# EAGLE design XBee_nRF52840_2.2_april_2022 (EAGLE 9.6.2)
COMPANY: JKSOFT Educational; REV: 1.1; TITLE: RPBee nRF52

## Sheet 1 of 2
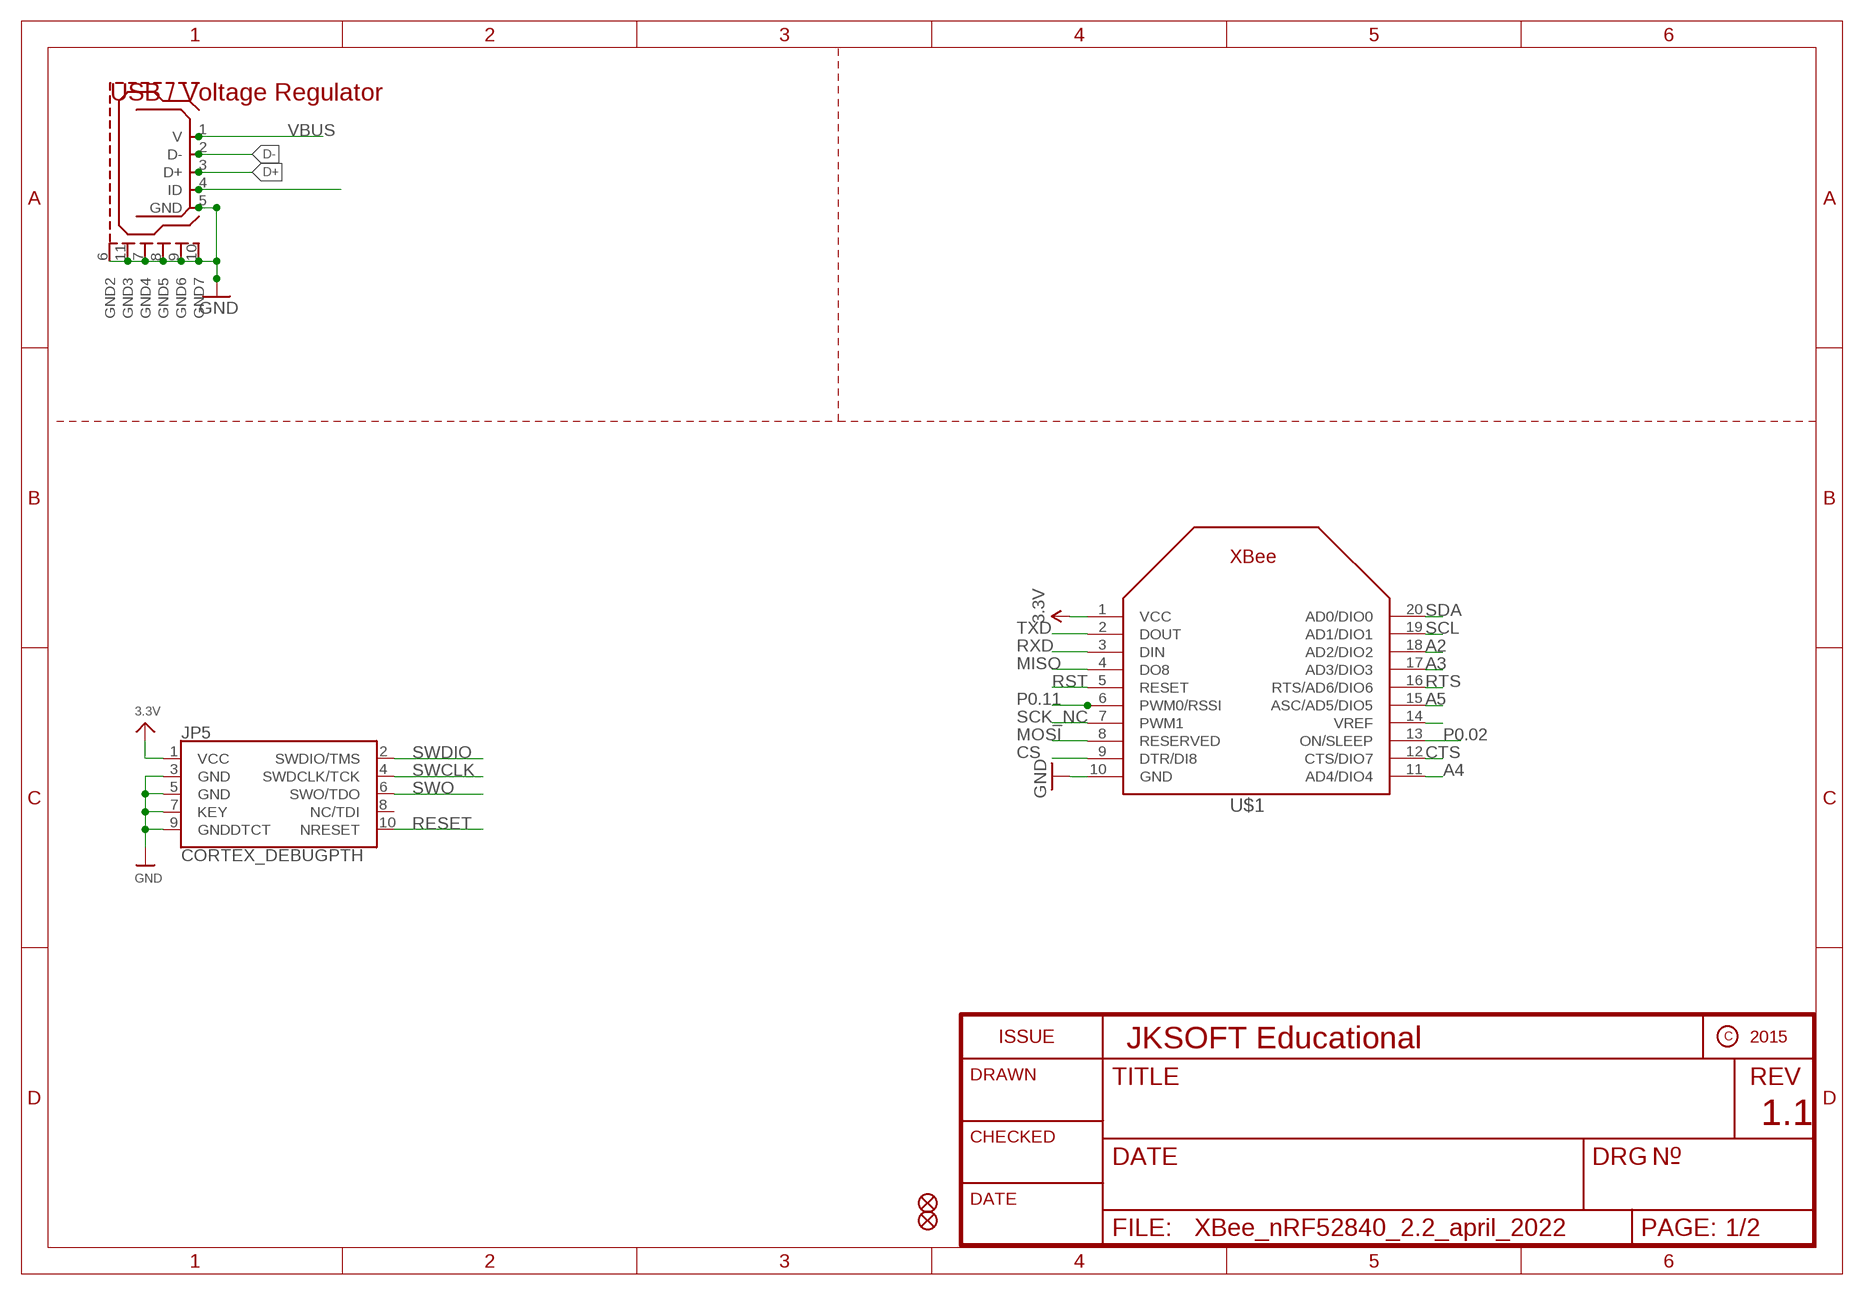
[diagram p0: schematic, sheet 1]

### Parts
FID1  FIDUCIAL_1MM  [FIDUCIAL_1MM]
FID3  FIDUCIAL_1MM  [FIDUCIAL_1MM]
JP5  CORTEX_DEBUGPTH  [2X5-PTH-1.27MM]
U$1  XBEE  [XBEE]
U$2  USB_MICROB  [USB_MICROB_PACKAGE]

### Nets
3.3V: JP5.1(VCC) U$1.1(VCC) ; also sheet 2
A2: U$1.18(AD2/DIO2) ; also sheet 2
A3: U$1.17(AD3/DIO3) ; also sheet 2
A4: U$1.11(AD4/DIO4) ; also sheet 2
A5: U$1.15(ASC/AD5/DIO5) ; also sheet 2
CS: U$1.9(DTR/DI8)
CTS: U$1.12(CTS/DIO7)
D+: U$2.3(D+) ; also sheet 2
D-: U$2.2(D-) ; also sheet 2
GND: JP5.3(GND) JP5.5(GND) JP5.7(KEY) JP5.9(GNDDTCT) U$1.10(GND) U$2.5(GND) U$2.6(GND2) U$2.7(GND4) U$2.8(GND5) U$2.9(GND6) U$2.10(GND7) U$2.11(GND3) ; also sheet 2
MISO: U$1.4(DO8) ; also sheet 2
MOSI: U$1.8(RESERVED) ; also sheet 2
N$2: U$1.14(VREF)
N$4: U$2.4(ID)
P0.02: U$1.13(ON/SLEEP)
P0.11: U$1.6(PWM0/RSSI)
RESET: JP5.10(NRESET) ; also sheet 2
RST: U$1.5(RESET)
RTS: U$1.16(RTS/AD6/DIO6)
RXD: U$1.3(DIN) ; also sheet 2
SCK_NC: U$1.7(PWM1)
SCL: U$1.19(AD1/DIO1) ; also sheet 2
SDA: U$1.20(AD0/DIO0) ; also sheet 2
SWCLK: JP5.4(SWDCLK/TCK) ; also sheet 2
SWDIO: JP5.2(SWDIO/TMS) ; also sheet 2
SWO: JP5.6(SWO/TDO) ; also sheet 2
TXD: U$1.2(DOUT) ; also sheet 2
VBUS: U$2.1(V) ; also sheet 2
Unconnected: JP5.8(NC/TDI)

### Notes on the sheet
- USB / Voltage Regulator

## Sheet 2 of 2
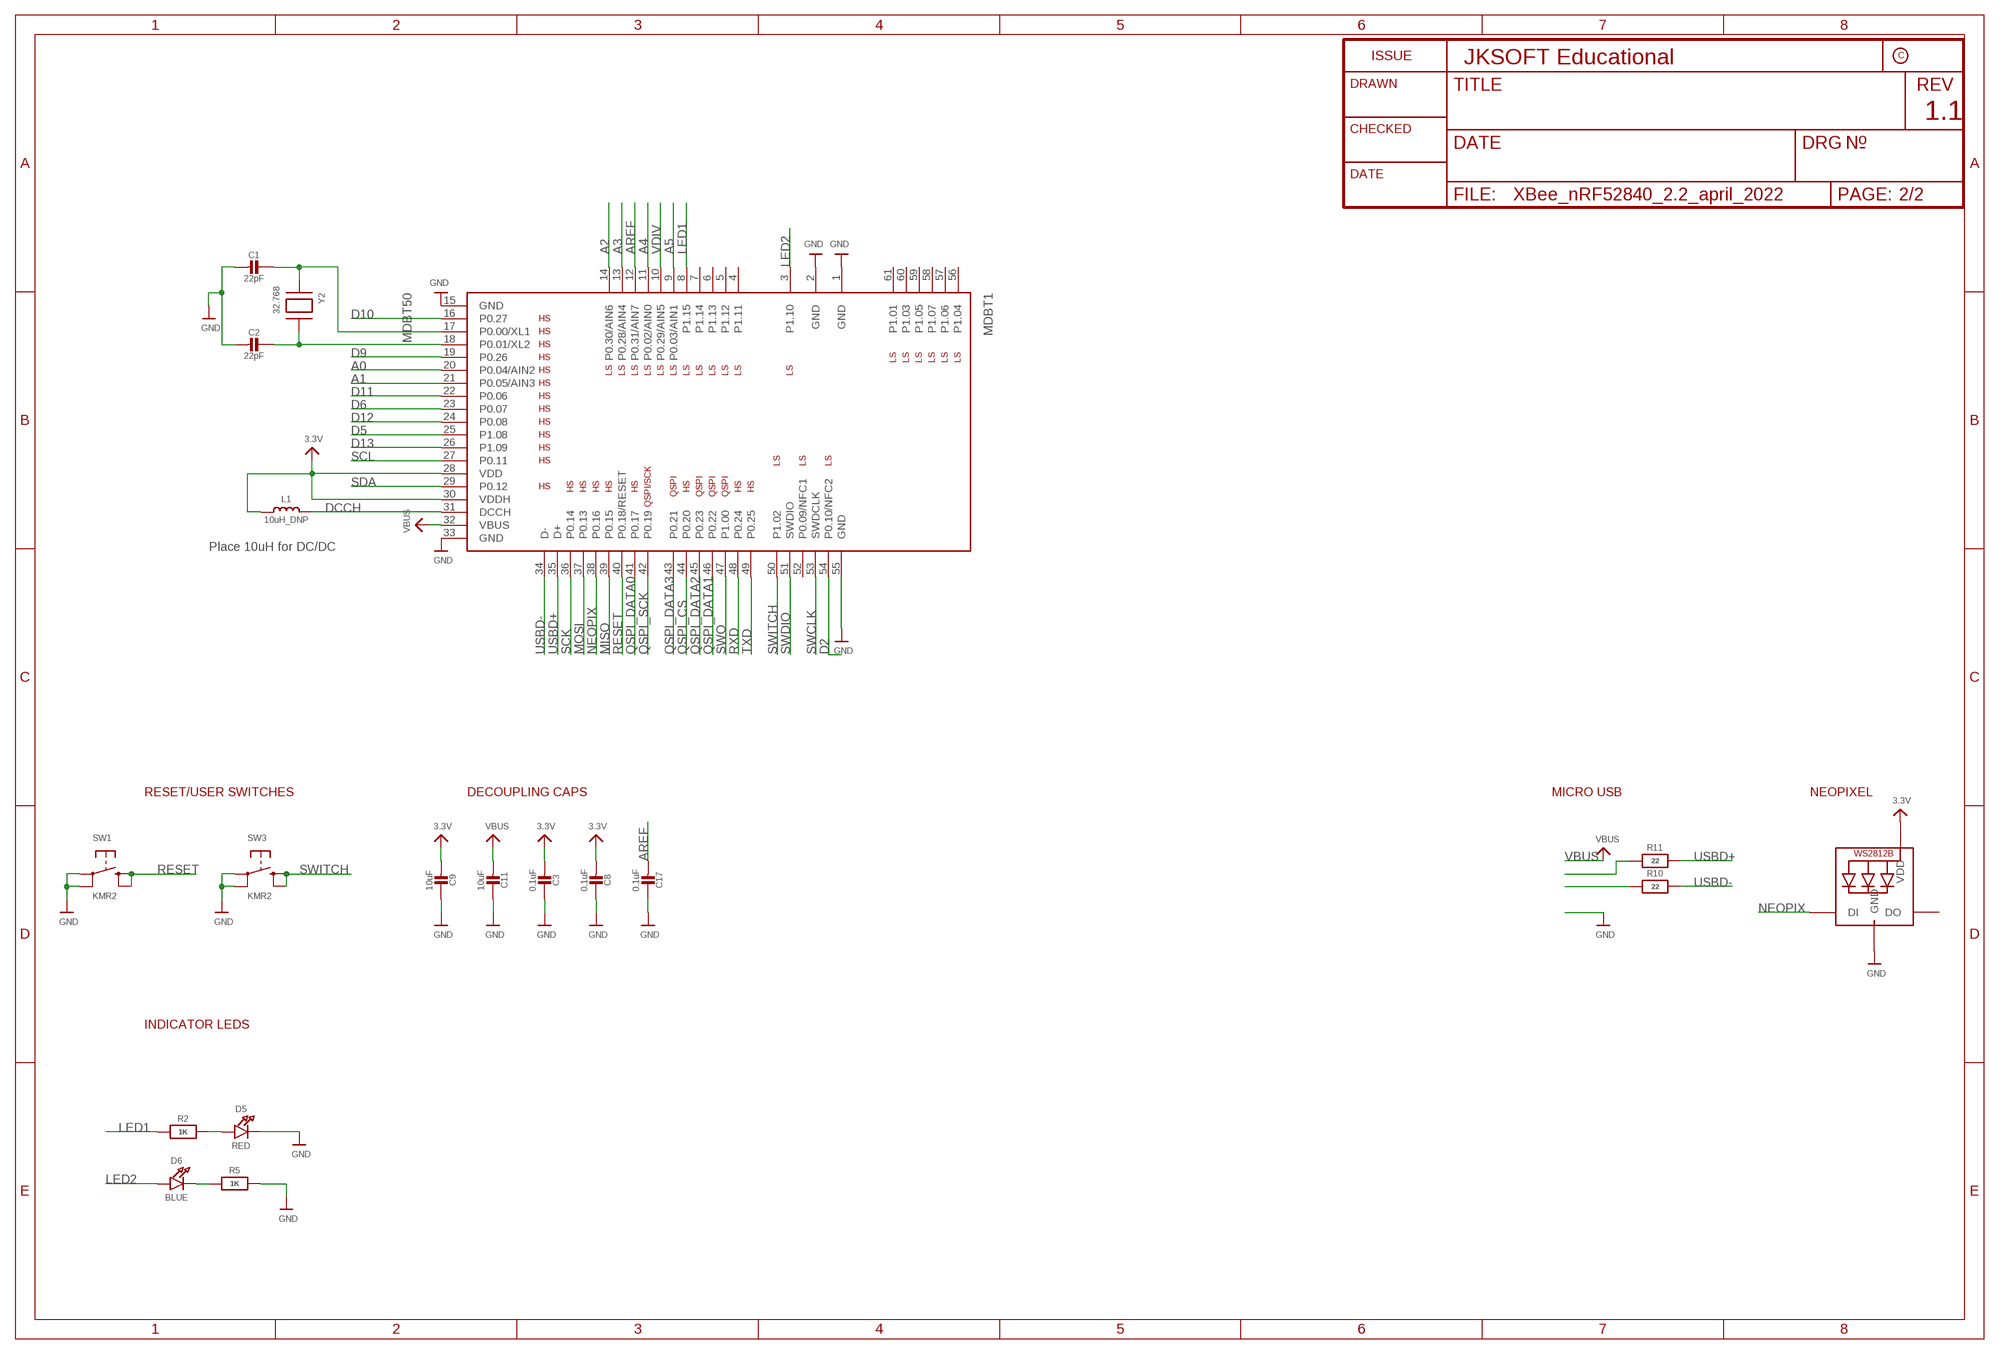
[diagram p1: schematic, sheet 2]

### Parts
C1  22pF  CAP_CERAMIC0603_NO  [0603-NO]
C2  22pF  CAP_CERAMIC0603_NO  [0603-NO]
C3  0.1uF  CAP_CERAMIC0603_NO  [0603-NO]
C8  0.1uF  CAP_CERAMIC0603_NO  [0603-NO]
C9  10uF  CAP_CERAMIC0805-NOOUTLINE  [0805-NO]
C11  10uF  CAP_CERAMIC0805-NOOUTLINE  [0805-NO]
C17  0.1uF  CAP_CERAMIC0603_NO  [0603-NO]
D5  RED  LED0805_NOOUTLINE  [CHIPLED_0805_NOOUTLINE]
D6  BLUE  LED0805_NOOUTLINE  [CHIPLED_0805_NOOUTLINE]
L1  10uH_DNP  INDUCTOR_0805MP  [_0805MP]
LED1  WS2812B3535  [LED3535]
MDBT1  MDBT50  [MDBT50]
R2  1K  RESISTOR_0603_NOOUT  [0603-NO]
R5  1K  RESISTOR_0603_NOOUT  [0603-NO]
R10  22  RESISTOR_0603_NOOUT  [0603-NO]
R11  22  RESISTOR_0603_NOOUT  [0603-NO]
SW1  KMR2  SWITCH_TACT_SMT4.6X2.8  [BTN_KMR2_4.6X2.8]
SW3  KMR2  SWITCH_TACT_SMT4.6X2.8  [BTN_KMR2_4.6X2.8]
Y2  32.768  XTAL-3.2X1.5  [XTAL3215]

### Nets
3.3V: C3.2 C8.2 C9.2 L1.1 LED1.2(VDD) MDBT1.28(VDD) MDBT1.30(VDDH) ; also sheet 1
A0: MDBT1.20(P0.04/AIN2)
A1: MDBT1.21(P0.05/AIN3)
A2: MDBT1.14(P0.30/AIN6) ; also sheet 1
A3: MDBT1.13(P0.28/AIN4) ; also sheet 1
A4: MDBT1.11(P0.02/AIN0) ; also sheet 1
A5: MDBT1.9(P0.03/AIN1) ; also sheet 1
AREF: C17.2 MDBT1.12(P0.31/AIN7)
D2: MDBT1.54(P0.10/NFC2)
D5: MDBT1.25(P1.08)
D6: MDBT1.23(P0.07)
D9: MDBT1.19(P0.26)
D10: MDBT1.16(P0.27)
D11: MDBT1.22(P0.06)
D12: MDBT1.24(P0.08)
D13: MDBT1.26(P1.09)
D+: R11.1 ; also sheet 1
D-: R10.1 ; also sheet 1
DCCH: L1.2 MDBT1.31(DCCH)
GND: C1.2 C2.2 C3.1 C8.1 C9.1 C11.1 C17.1 D5.C LED1.4(GND) MDBT1.1(GND) MDBT1.2(GND) MDBT1.15(GND) MDBT1.33(GND) MDBT1.55(GND) R5.2 SW1.A'(P1) SW1.A(P) SW3.A'(P1) SW3.A(P) ; also sheet 1
LED1: MDBT1.8(P1.15) R2.1
LED2: D6.A MDBT1.3(P1.10)
MISO: MDBT1.39(P0.15) ; also sheet 1
MOSI: MDBT1.37(P0.13) ; also sheet 1
N$1: C1.1 MDBT1.17(P0.00/XL1) Y2.P$1
N$5: C2.1 MDBT1.18(P0.01/XL2) Y2.P$2
N$14: D6.C R5.1
N$15: D5.A R2.2
NEOPIX: LED1.1(DI) MDBT1.38(P0.16)
QSPI_CS: MDBT1.44(P0.20)
QSPI_DATA0: MDBT1.41(P0.17)
QSPI_DATA1: MDBT1.46(P0.22)
QSPI_DATA2: MDBT1.45(P0.23)
QSPI_DATA3: MDBT1.43(P0.21)
QSPI_SCK: MDBT1.42(P0.19)
RESET: MDBT1.40(P0.18/RESET) SW1.B'(S1) SW1.B(S) ; also sheet 1
RXD: MDBT1.48(P0.24) ; also sheet 1
SCK: MDBT1.36(P0.14)
SCL: MDBT1.27(P0.11) ; also sheet 1
SDA: MDBT1.29(P0.12) ; also sheet 1
SWCLK: MDBT1.53(SWDCLK) ; also sheet 1
SWDIO: MDBT1.51(SWDIO) ; also sheet 1
SWITCH: MDBT1.50(P1.02) SW3.B'(S1) SW3.B(S)
SWO: MDBT1.47(P1.00) ; also sheet 1
TXD: MDBT1.49(P0.25) ; also sheet 1
USBD+: MDBT1.35(D+) R11.2
USBD-: MDBT1.34(D-) R10.2
VBUS: C11.2 MDBT1.32(VBUS) ; also sheet 1
VDIV: MDBT1.10(P0.29/AIN5)
Unconnected: LED1.3(DO) MDBT1.4(P1.11) MDBT1.5(P1.12) MDBT1.6(P1.13) MDBT1.7(P1.14) MDBT1.52(P0.09/NFC1) MDBT1.56(P1.04) MDBT1.57(P1.06) MDBT1.58(P1.07) MDBT1.59(P1.05) MDBT1.60(P1.03) MDBT1.61(P1.01)

### Notes on the sheet
- Place 10uH for DC/DC
- RESET/USER SWITCHES | DECOUPLING CAPS | MICRO USB | NEOPIXEL
- INDICATOR LEDS

## Library data of the parts
C1-C3 C8 C9 C11 C17 = microbuilder:CAP_CERAMIC: Ceramic Capacitors For new designs, use the packages preceded by an '_' character since they are more reliable: The following footprints should be used on most boards: _0402 - Standard footprint for regular board layouts _0603 - Standard footprint for regular board layouts _0805 - Standard footprint for regular board layouts _1206 - Standard footprint for regular board layouts For extremely tight-pitch boards where space is at a premium, the following 'micro-pitch' footprints can be used (smaller pads, no silkscreen outline, etc.): _0402MP - Micro-pitch footprint for very dense/compact boards _0603MP - Micro-pitch footprint for very dense/compact boards _0805MP - Micro-pitch footprint for very dense/compact boards _1206MP - Micro-pitch footprint for very dense/compact boards
D5 D6 = microbuilder:LED: LED 0603 - 0603 Surface Mount Package 2mA: Green LED - Low Power (3.9mcd, 2ma, 1.7Vf) - Digikey: 475-2709-2-ND Orange LED - Low Power (9.8mcd, 2ma, 1.8Vf) - Digikey: 475-1194-2-ND Red LED - Low Power (5mcd, 2ma, 1.8Vf) - Digikey: 475-1195-2-ND Yellow LED - Low Power (7mcd, 2ma, 1.8Vf) - Digikey: 475-1196-2-ND 5mA: Blue LED - Low Power (17mcd, 5ma, 2.9Vf) - Digikey: LNJ937W8CRACT-ND 0805 - 0805 Surface Mount Package 2mA: Red LED (8.8mcd, 2mA, 1.8Vf, Clear) - Low Power [Digikey: 475-2510-1-ND] Green LED (5mcd, 2mA, 1.8Vf, Clear) - Low Power [Digikey: 475-2730-1-ND] Yellow LED (11.3mcd, 2mA, 1.8Vf, Clear) - Low Power [Digikey: 475-2555-1-ND] 20mA: Red LED (104mcd, 20mA, Diffused) - LS R976 [Digikey: 475-1278-6-ND] Red LED (12mcd, 20mA, 2.0Vf, Clear) - APT2012EC [Digikey: 754-1128-1-ND] Green LED (15mcd, 20mA, 2.2Vf, Clear) - APT2012GC [Digikey: 754-1131-1-ND] Orange LED (160mcd, 20mA, 2.1Vf, Clear) - APT2012SECK [Digikey: 754-1130-1-ND] 1206 - 1206 Surface Mount Package Green LED (26mcd, 20mA, Diffused) - LG N971 [Digikey: 475-1407-6-ND] Red LED (15mcd, 20mA, Diffused) - LH N974 [Digikey: 475-1416-6-ND] Cree - Cree High-Power Surface Mount LEDs XPEBWT-L1-0000-00D50 - White 111lm 350mA 2.9Vf 6200K 110° XTEAWT-00-0000-00000LEE3 - White 114lm 350mA 2.85Vf 5000K 115° Everlight - Everlight 45-21 Series Surface Mount LEDs 45-21/QK2C-B2832AC2CB2/2T - Warm White 2000mcd 20mA 3.25Vf 3050K 120° 45-21/LK2C-B38452C4CB2/2T - Nuetral White 2000mcd 20mA 3.25Vf 4150K 120° 45-21/LK2C-B50634C6CB2/2T - Cold White 2200mcd 20mA 3.25Vf 5650K 120° PLCC2 Reverse Mount LS T77K-J1L2-1-0-2-R18-Z - Red 11.25mcd 2mA 1.8Vf 630nm 120° LO T77K-L1M2-24-Z - Orange 19.6mcd 2mA 1.8Vf 606nm 120° LY T77K-K2M1-26-Z - Yellow 15.7mcd 2mA 1.8Vf 587nm 120°
FID1 FID3 = microbuilder:FIDUCIAL: Fiducial Alignment Points Various fiducial points for machine vision alignment.; BOM: EXCLUDE
JP5 = samd21-temp:CORTEX_DEBUG: Cortex Debug Connector Datasheet <http://infocenter.arm.com/help/topic/com.arm.doc.faqs/attached/13634/cortex_debug_connectors.pdf>
L1 = microbuilder:INDUCTOR: Inductors 0603: 10nH Ceramic Inductor - microwire antenna/RF (Digikey: 712-1434-2-ND) 0805: 560nH Ceramic Inductor - RF (Digikey: 553-1047-1-ND) 270nH Ceramic Inductor - Q = 40@250MHz, +-5%, 1 Ohm DC Resistance (Digikey: 535-10506-2-ND) 1007 (2518 Metric) SMT: 10µH 10% 250mOhm 820mA 1007 Inductor (Digikey: 587-2189-1-ND) 22µH 10% 500mOhm 580mA 1007 Inductor (Digikey: 587-2190-1-ND) 47µH 10% 950mOhm 420mA 1007 Inductor (Digikey: 587-2191-1-ND) 47µH 5% 100mOhm 1A 1008 Inductor (Digikey: 732-1816-1-ND) 5.0x5.0mm (Taiyo Yuden NR5040 Series) 6.8µH 20% 2.3A 64mOhm Inductor (Digikey: 587-2374-2-ND) 5.0x5.0mm (TDK VLC5045 Series) 4.7µH 20% 3.3A 34mOhm Inductor (Digikey: 445-6526-1-ND) 6.8µH 20% 2.7A 46mOhm Inductor (Digikey: 445-6527-1-ND) 6.0x6.0mm (TDK VLC6045 Series) 4.7µH 20% 3.8A 27mOhm Inductor (Digikey: 445-6538-2-ND) 6.8µH 20% 3A 41mOhm Inductor (Digikey: 445-6540-1-ND) 6.2µH 30% 2.2A 45mOhm Inductor (Digikey: SRR5028-6R2YCT-ND) - Not TDK VLC6045 but footprint should match 6.0x6.0mm (TDK SLF6045 Series) 6.8uH 30% 2A 33mOhm Inductor (Digikey: 445-4572-1-ND, Mouser: 810-SLF645T6R8N2R0PF) 6.0x6.0mm (Sumida CDRH5D28 Series) 6.2uH 30% 1.8A 45mOhm Inductor (Digikey: 308-1542-1-ND) Taiyo Yuden NR3015T2R2M - 2.2uH 20% 1.5A (Digikey: 587-1648-2-ND, Mouser: 963-NR3015T2R2M) - Used with TI TPS62172 CoilCraft RFID Transponder Coil - MA5532-AE (For use with AS3935 Lightning Sensor) Taiyo Yuden NRH2412T2R2MNGH - 2.2uH 20% 1AA (Digikey: 587-3443-1-ND) - Used with TI LM3671 Vishay IHLP 1.0uH Molded Inductor - 24mOhm DCR, 5A, +/-20%, -55°C-125°C (Digikey: 541-1319-1-ND)
LED1 = microbuilder:WS2812B
MDBT1 = microbuilder:MDBT50: Raytac Corporation MDBT50 Bluetooth Low Energy Module based on Noridc nRF52840 Source: Raytac datasheet
R2 R5 R10 R11 = microbuilder:RESISTOR: Resistors For new designs, use the packages preceded by an '_' character since they are more reliable: The following footprints should be used on most boards: _0402 - Standard footprint for regular board layouts _0603 - Standard footprint for regular board layouts _0805 - Standard footprint for regular board layouts _1206 - Standard footprint for regular board layouts For extremely tight-pitch boards where space is at a premium, the following 'micro-pitch' footprints can be used (smaller pads, no silkscreen outline, etc.): _0402MP - Micro-pitch footprint for very dense/compact boards _0603MP - Micro-pitch footprint for very dense/compact boards _0805MP - Micro-pitch footprint for very dense/compact boards _1206MP - Micro-pitch footprint for very dense/compact boards
SW1 SW3 = microbuilder:SWITCH_TACT_SMT: SMT Tact Switches 6x6mm - Digikey: P12940SCT-ND KMR2 (4.6x2.8mm) - Digikey: 401-1426-1-ND EVQ-PQHB55 - Light Touch, 160GF (4.5x4.5mm) - Digikey: P8090SCT-ND KMT0 - KMT021 NGJ LHS (etc.) IP68/Waterproof - Digikey: CKN10289CT-ND
U$1 = adafruit:XBEE
U$2 = femtoduino:USB_MICROB: This is the hirose ZX62-B-5PA(11) MICRO-USB B Type female connection.
Y2 = adafruit2:XTAL: Low cost SMT crystals, no capacitors included http://www.ladyada.net/library/eagle

## Net classes
1 power: width 0.254 mm

## Board
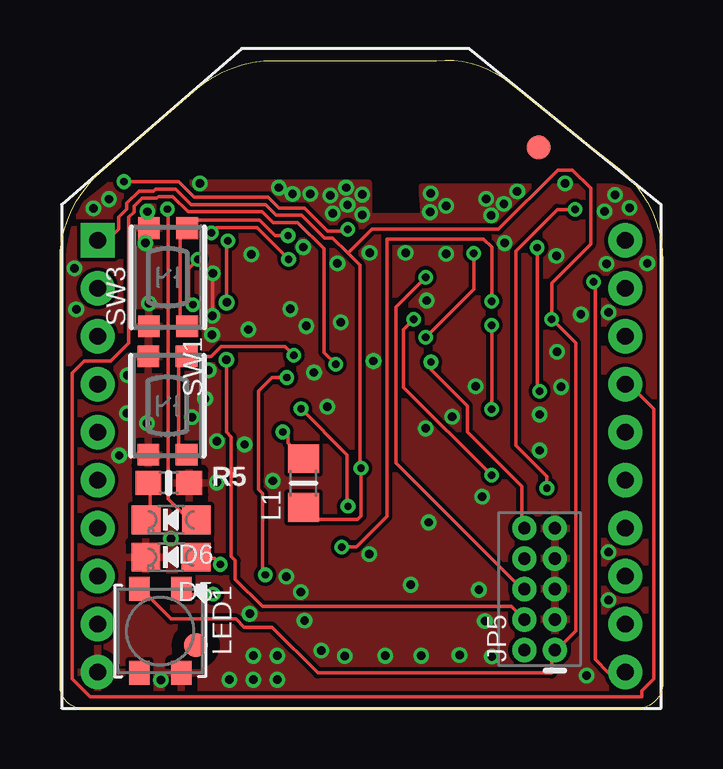
[diagram p2: board, top side]
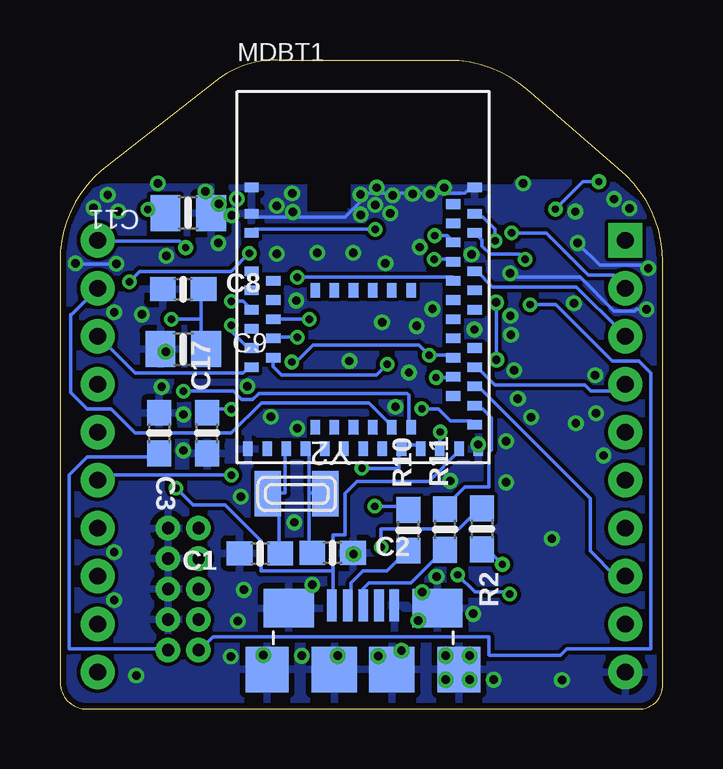
[diagram p3: board, bottom side, seen from below]

Size 25.14 x 27.06 mm. Coordinates in mm from the lower left corner, seen from the top.
Outline: 1.85,22.53 5.65,25.82 arc-41 8.93,27.04 15.69,27.04 arc-41 18.47,26.31 23.42,22.45 arc-49 25.14,18.67 25.14,1.09 arc-90 24,0 1,0 arc-90 0,1 0,18.64 arc-51 1.85,22.53
Copper layers (1*16): Top 0.035mm / dielectric 1.5mm / Bottom 0.035mm
Design rules "SeeedStudio_2layer_DRU_no_angle_20140221": minimum track width 6mil, minimum drill 12mil, track to track 6mil, track to pad 6mil, pad to pad 6mil, via to via 6mil, smd to smd 0mil, copper to edge 10mil, drill to drill 10mil, minimum pad ring 10mil, minimum via ring 6mil, stop-mask expansion 2mil, vias tented up to drill 100mil, thermal gap 10mil

### Footprints (pad centres in the part's own frame; a part is rotated, then mirrored left to right if it is on the bottom)
0603-NO = smd 1.075 x 1: 1 -0.85,0; 2 0.85,0
0805-NO = smd 1.24 x 1.5: 1 -0.95,0; 2 0.95,0
CHIPLED_0805_NOOUTLINE = smd 1.2 x 1.2: A 0,-1.05; C 0,1.05
FIDUCIAL_1MM = smd 1 x 1: 1 0,0
2X5-PTH-1.27MM = drill 0.508 pad 1: 1 -2.54,-0.635; 2 -2.54,0.635; 3 -1.27,-0.635; 4 -1.27,0.635; 5 0,-0.635; 6 0,0.635; 7 1.27,-0.635; 8 1.27,0.635; 9 2.54,-0.635; 10 2.54,0.635
_0805MP = smd 1.2 x 1.3: 1 -1.016,0; 2 1.016,0
LED3535 = smd 1 x 0.85: 1 -1.75,0.875; 2 -1.75,-0.875; 3 1.75,-0.875; 4 1.75,0.875
MDBT50 = smd 0.6 x 0.4: 1 -4.65,3.75; 2 -4.65,2.65; 3 -4.65,1.85; 4 -4.65,0.25; 5 -3.75,-0.15; 6 -4.65,-0.55; 7 -3.75,-0.95; 8 -4.65,-1.35; 9 -3.75,-1.75; 10 -4.65,-2.15; 11 -3.75,-2.55; 12 -4.65,-2.95; 13 -3.75,-3.35; 14 -4.65,-3.75; 34 4.65,-6.15; 35 4.65,-5.35; 36 3.75,-4.95; 37 4.65,-4.55; 38 3.75,-4.15; 39 4.65,-3.75; 40 3.75,-3.35; 41 4.65,-2.95; 42 3.75,-2.55; 43 3.75,-1.75; 44 4.65,-1.35; 45 3.75,-0.95; 46 4.65,-0.55; 47 3.75,-0.15; 48 4.65,0.25; 49 3.75,0.65; 50 3.75,1.45; 51 4.65,1.85; 52 3.75,2.25; 53 4.65,2.65; 54 3.75,3.05; 55 4.65,3.75 | smd 0.4 x 0.6: 15 -4.8,-7.15; 16 -4,-7.15; 17 -3.2,-7.15; 18 -2.4,-7.15; 19 -2,-6.25; 20 -1.6,-7.15; 21 -1.2,-6.25; 22 -0.8,-7.15; 23 -0.4,-6.25; 24 0,-7.15; 25 0.4,-6.25; 26 0.8,-7.15; 27 1.2,-6.25; 28 1.6,-7.15; 29 2,-6.25; 30 2.4,-7.15; 31 3.2,-7.15; 32 4,-7.15; 33 4.8,-7.15; 56 -2,-0.55; 57 -1.2,-0.55; 58 -0.4,-0.55; 59 0.4,-0.55; 60 1.2,-0.55; 61 2,-0.55
BTN_KMR2_4.6X2.8 = smd 0.9 x 0.9: A 2.05,0.8; A' -2.05,0.8; B 2.05,-0.8; B' -2.05,-0.8
XBEE = drill 0.7 pad 1.422 square: 1 -11,5.5 | drill 0.7 pad 1.422: 2 -11,3.5; 3 -11,1.5; 4 -11,-0.5; 5 -11,-2.5; 6 -11,-4.5; 7 -11,-6.5; 8 -11,-8.5; 9 -11,-10.5; 10 -11,-12.5; 11 11,-12.5; 12 11,-10.5; 13 11,-8.5; 14 11,-6.5; 15 11,-4.5; 16 11,-2.5; 17 11,-0.5; 18 11,1.5; 19 11,3.5; 20 11,5.5
USB_MICROB_PACKAGE = smd 0.4 x 1.35: 1 -1.3,-0.68; 2 -0.64,-0.68; 3 0,-0.68; 4 0.66,-0.68; 5 1.3,-0.68 | smd 2.1 x 1.6: 6 -3.1,-0.8; 11 3.1,-0.8 | smd 1.8 x 1.9: 7 -4,-3.35; 10 4,-3.35 | smd 1.9 x 1.9: 8 -1.2,-3.35; 9 1.2,-3.35
XTAL3215 = smd 1.1 x 1.9: P$1 1.2,0; P$2 -1.2,0

### Placement (x,y rotation side)
C1  16.8,6.49 180 bottom
C2  13.77,6.51 0 bottom
C3  21,11.5 270 bottom
C8  20,17.5 0 bottom
C9  20,15 0 bottom
C11  19.79,20.68 180 bottom
C17  19,11.5 90 bottom
D5  4.63,6.33 90 top
D6  4.64,7.89 90 top
FID1  19.95,23.41 0 top
FID3  5.66,2.66 0 top
JP5  20,5 90 top
L1  10.15,9.42 90 top
LED1  4.18,3.25 270 top
MDBT1  12.5,18 0 bottom
R2  7.55,7.51 270 bottom
R5  4.54,9.43 0 top
R10  10.61,7.45 90 bottom
R11  9.08,7.48 90 bottom
SW1  4.48,12.65 90 top
SW3  4.5,18 90 top
U$1  12.57,14.04 0 top
U$2  12.5,5 0 bottom
Y2  15.27,8.97 180 bottom

### Tracks (layer width: path | path; a pad name or v marks a point on that pad's centre or on a via)
3.3V  (via drill 0.3)
  Top 0.152: L1.1 10.15,8.07 10.32,7.9 12.4,7.9 12.56,8.06 v12.56,10.03 v12.55,10.04 12.5,10.09 12.5,18.5 12,19 | U$1.1 1.97,19.54 2.44,20.01 2.44,20.5 2.79,20.85 2.79,21.1 3.29,21.6 3.92,21.6 3.99,21.68 4.83,21.68 5.47,21.04 8.56,21.04 9.01,20.59 10.07,20.59 11.04,19.62 11.38,19.62 12,19 | 12,19 13,20 18.29,20 20.76,22.47 21.37,22.47 22.13,21.71 22.13,19.38 20.5,17.75 v20.5,16.25 21.5,15.25 21.5,3.25 20.75,2.5 JP5.1 20.5,2.25 20.5,1.5 10.75,1.5 8.84,3.41 7.68,3.41 7.34,3.75 4.62,3.75 3.38,5 LED1.2
  Bottom 0.152: MDBT1.30 10.25,11 10.75,11 MDBT1.28 11,10.75 11,10.04 v12.55,10.04 | 19.25,16.25 19.25,15 C9.2 | 19.25,16.25 19.25,17.5 C8.2 | C3.2 21,10.5 24,10.5 24.75,9.75 24.75,2.5 20.75,2.5 JP5.1 | v20.5,16.25 19.25,16.25
A2
  Bottom 0.152: MDBT1.14 17.25,14.25 17.5,14 22,14 23.5,15.5 U$1.18
A3  (via drill 0.3)
  Top 0.152: v11.5,14.38 11.01,14.87 11.01,19.19 9.92,20.28 8.88,20.28 8.43,20.73 5.34,20.73 4.7,21.37 4.12,21.37 4.04,21.3 3.42,21.3 3.09,20.97 3.09,20.72 2.87,20.5 2.87,15.26 2.11,14.5 1,14.5 0.5,14 0.5,1.25 1.25,0.5 24.25,0.5 24.25,0.75 24.75,1.25 24.75,12.5 23.75,13.5 U$1.17
  Bottom 0.152: v11.5,14.38 11.95,13.93 15.91,13.93 16.25,14.27 MDBT1.13
A4  (via drill 0.3)
  Top 0.152: v15.25,15.5 17.25,17.5 v17.25,19 | v22.25,17.81 22.32,17.74 22.32,2.07 22.85,1.54 U$1.11
  Bottom 0.152: v15.25,15.5 16.25,15.5 MDBT1.11 | v17.25,19 18.01,18.24 21.82,18.24 v22.25,17.81
A5  (via drill 0.3)
  Top 0.152: v14.75,16.25 14.33,15.83 14.33,13.41 v17.99,9.75 v18,9.75
  Bottom 0.152: v14.75,16.25 MDBT1.9 | v18,9.75 23.5,9.75 U$1.15
AREF  (via drill 0.3)
  Top 0.152: v18,12.5 v18,16
  Bottom 0.152: v18,16 18,15.75 17.25,15 MDBT1.12 | v18,12.5 19,12.5 C17.2
D+
  Bottom 0.152: U$2.3 12.5,5 12.25,5.25 10.5,5.25 9.25,6.5 R11.1
D-
  Bottom 0.152: R10.1 10.75,6.5 11.5,5.75 12.5,5.75 13,5.25 13,4.5 U$2.2
DCCH  (via drill 0.3)
  Top 0.152: v9.29,11.55 9.5,11.34 9.5,11.09 L1.2
  Bottom 0.152: v9.29,11.55 9.29,10.88 MDBT1.31
GND  (via drill 0.35)
  Top 0.152: v6.37,18.16 v6.37,16.41 v6.36,16.4
  Bottom 0.152: MDBT1.55 8,21.75 8.25,21.5 12.25,21.5 13.25,20.5 17,20.5 MDBT1.2 | v22.79,18.56 24.47,18.56 v24.49,18.58 | v0.61,18.37 0.74,18.5 2.63,18.5 v3.56,19.43 | v0.68,16.67 1.11,16.67 1.18,16.6 2.04,16.6 3.44,18 6.21,18 v6.37,18.16
  other vias: 2.79,12.33 2.47,10.57 6.54,11.16 6.05,12.94 6.2,14.12 7.86,15.82 9.61,16.68 11.71,16.12 11.57,18.58 12.91,19.02 14.41,19.02 11.15,12.6 10.59,14.03 16.35,12.19 15.25,11.7 15.37,7.78 17.47,4.97 16.66,2.25 13.56,2.22 8.06,2.22 21.96,1.4 20,12.28 20,10.78 17.6,8.85 16.1,18.98 16.1,20.98 11.37,20.66 3.65,20.74 18.51,21.06 18.54,19.43 20.7,18.89 21.72,16.45 20.73,14.9 22.71,20.75 11.27,21.41 12.9,6.46 10.04,4.87 6.54,9.45 11.87,2.21 6.34,15.6 10.14,19.26 7.7,11.03 22.88,16.54 22.88,6.54 22.88,4.54 17.33,13.46 13.07,14.51 2.82,13.91 8.87,9.51 1.39,20.87 2.04,21.26 23.15,21.44 23.75,20.89 4.63,7.1 9.44,5.52 17.72,3.66 18.01,2.19 9.7,21.48 10.44,21.48 15.46,21.5 15.43,20.72 12.61,21.45 11.99,21.02 12.6,20.61 19.07,21.58 5.83,21.91 9.12,21.74 11.93,21.74 17.98,20.58 17.77,21.27 21.06,21.91 7.98,18.96 3.63,11.92 5.5,12.17 3.71,16.92 20.9,13.43 8.06,1.22 9.06,1.22 9.06,2.22 15.06,2.22 10.9,2.44 10.2,3.69 7.91,3.97 7.06,1.22 4.21,1.21 10.27,15.97 15.29,17.03 14.62,5.18
  pour Top: 23.71,0.15 1.4,0.15 arc-90 0.05,1.5 0.05,18.76 arc-54 1.32,21.25 2.15,21.92 12.86,21.92 12.86,20.53 15.2,20.53 15.09,21.76 22.91,21.76 arc-68 24.63,20.59 arc-26 24.82,19.33 24.82,1.26 arc-90
  pour Bottom: 23.56,0 0.05,0 0.05,18.76 arc-54 1.32,21.25 2.15,21.92 12.86,21.92 12.86,20.7 15.01,20.94 14.93,21.76 22.91,21.76 arc-68 24.63,20.59 arc-26 24.82,19.33 24.82,1.26 arc-90
LED1  (via drill 0.3)
  Top 0.152: v18,17 18,19.25 17.65,19.6 13.63,19.6 13.63,8.02 12.36,6.75 v11.75,6.75
  Bottom 0.152: MDBT1.8 17.5,17 v18,17 | v11.75,6.75 11.75,7.5 8.5,7.5 7.75,8.25 R2.1
LED2  (via drill 0.3)
  Top 0.152: v12,20 11.93,19.93 11.16,19.93 10.2,20.89 9.14,20.89 8.68,21.35 5.59,21.35 4.95,21.99 v2.67,21.99 | v4.48,20.84 4.5,20.82 4.5,8.75 5.5,7.75 D6.A
  Bottom 0.152: v12,20 17,20 MDBT1.3 | v2.67,21.99 3.33,21.99 v4.48,20.84
MISO
  Bottom 0.152: MDBT1.39 7.75,14.25 7,13.5 3.25,13.5 3,13.25 2,13.25 1.75,13.5 U$1.4
MOSI
  Bottom 0.152: U$1.8 1.98,5.54 3.03,6.59 3.03,8.78 7.75,13.5 MDBT1.37
N$1
  Bottom 0.152: 16,9 16.25,9 Y2.P$1 16,9 | 16,9 15.75,9 15.75,10.75 MDBT1.17 | 16,9 16,6.5 C1.1
N$5
  Bottom 0.152: 14.75,9 14.75,10.75 MDBT1.18 | 14.75,9 14.25,9 Y2.P$2 | 14.75,9 14.75,6.75 C2.1
N$14
  Top 0.152: R5.1 3.75,9.25 3.75,8 D6.C
N$15  (via drill 0.3)
  Top 0.152: v6.69,6.03 6.45,6.27 5.73,6.27 D5.A
  Bottom 0.152: R2.2 7.32,6.66 v6.69,6.03
NEOPIX  (via drill 0.3)
  Top 0.152: v8.56,5.59 8.44,5.71 8.44,8.99 8.29,9.15 8.29,13.27 8.84,13.82 v9.46,13.82 | v6.38,4.79 5.26,4.79 LED1.1
  Bottom 0.152: v9.46,13.82 8.75,13.82 MDBT1.38 | v6.38,4.79 6.47,4.88 7.84,4.88 v8.56,5.59
RESET  (via drill 0.3)
  Top 0.152: SW1.B' 4.94,10.6 4.94,14.35 4.95,14.37 SW1.B 6.29,14.7 6.71,15.12 9.38,15.12 v9.75,14.75 | v15.47,14.47 15.47,14.15 16.98,12.64 16.98,11.55 19.25,9.28 19.25,7.75 JP5.10
  Bottom 0.152: v15.47,14.47 15.38,14.38 14.58,15.18 10.18,15.18 v9.75,14.75 8.75,14.75 MDBT1.40
RXD
  Bottom 0.152: MDBT1.48 7.75,18.25 7.1,17.6 3.6,17.6 1.75,15.75 U$1.3
SCL
  Bottom 0.152: MDBT1.27 11.25,11.75 12.26,12.76 16.74,12.76 18,11.5 22,11.5 23,12.5 24,12.5 24.7,13.2 24.7,16.45 24.68,16.45 24.65,16.46 U$1.19
SDA  (via drill 0.3)
  Top 0.152: v20,13.25 19.9,13.35 v19.9,19.24
  Bottom 0.152: MDBT1.29 10.59,11.84 10.59,13.09 10.66,13.16 16.84,13.16 17.1,12.9 17.56,12.9 17.91,13.25 v20,13.25 | v19.9,19.24 20.16,19.5 23.5,19.5 U$1.20
SWCLK  (via drill 0.3, 0.35)
  Top 0.152: v6.95,16.95 6.95,19.47 v7,19.52 | v6.94,14.56 6.94,11.55 7.14,11.34 7.14,6.36 7.31,6.19 7.31,5.4 8.44,4.27 18.82,4.27 JP5.4
  Bottom 0.152: v7,19.52 7,20 7.5,20.5 7.75,20.5 MDBT1.53 | v6.94,14.56 v6.94,16.94 v6.95,16.95
SWDIO  (via drill 0.3)
  Top 0.152: v5.75,18.75 5.36,18.36 5.36,16.86 v5.54,16.86
  Bottom 0.152: v5.54,16.86 4.47,16.86 3.06,15.45 2.11,14.5 1,14.5 0.5,14 0.5,2.5 1.5,2.5 4,2.5 4.27,2.23 7.23,2.23 7.25,2.25 7.25,3 18.75,3 19.25,2.5 JP5.2 | v5.75,18.75 5.97,18.97 7.2,18.97 7.54,19.31 7.54,19.54 MDBT1.51
SWITCH  (via drill 0.3)
  Top 0.152: SW3.B' 5,16.25 5,19.75 SW3.B 5.63,20.39 8.33,20.39 8.97,19.74 v9.51,19.74
  Bottom 0.152: v9.51,19.74 8.99,19.74 8.75,19.5 MDBT1.50
SWO  (via drill 0.3)
  Top 0.152: v15.25,18 14,16.75 14,10.25 19.25,5 JP5.6
  Bottom 0.152: v15.25,18 8.75,18 MDBT1.47
TXD  (via drill 0.3)
  Top 0.152: v9.53,18.75 8.21,20.07 6.53,20.07 v6.31,19.85
  Bottom 0.152: v9.53,18.75 8.75,18.75 MDBT1.49 | v6.31,19.85 4.86,19.85 3.11,18.1 2.05,18.1 U$1.2
USBD+
  Bottom 0.152: MDBT1.35 7.75,12.5 7.5,12.5 7.14,12.14 7.14,10.8 7.25,10.69 7.25,9.25 8.25,9.25 9,8.5 R11.2
USBD-  (via drill 0.3)
  Top 0.152: v10.05,12.52 11.97,10.6 11.97,8.49 v12.01,8.45
  Bottom 0.152: v10.05,12.52 10.03,12.5 9.35,12.5 8.85,12 8,12 MDBT1.34 | v12.01,8.45 10.71,8.45 R10.2
VBUS  (via drill 0.3)
  Top 0.152: v21.48,20.83 20.73,20.83 19,19.1 19,10.99 20.3,9.69 v20.3,9.21
  Bottom 0.152: 13.75,5.75 13.75,4.5 U$2.1 | 13.75,5.75 13.75,7.25 13.25,7.25 13.25,8.99 12.75,9.49 9.76,9.49 8.5,10.75 MDBT1.32 | C11.2 20.89,20.83 v21.48,20.83 | v20.3,9.21 19.59,8.5 18.25,8.5 16.75,7 16.75,5.75 13.75,5.75

### Text on the board
_tsilk: RobotPatient.com | nRF52840
_bsilk: RobotPatient.com